# Altium project Subway.PrjPcb
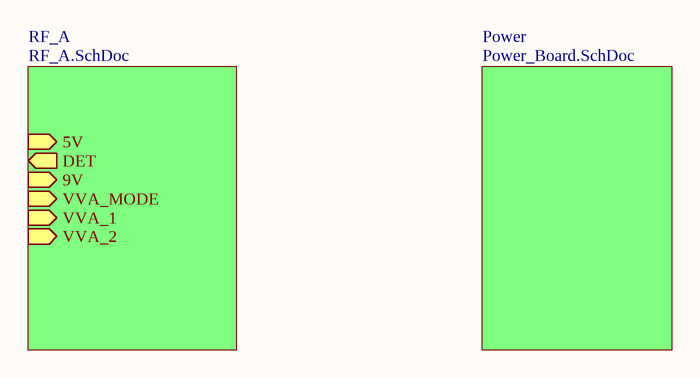
[diagram p0: Top_Subway.SchDoc]
3 sheets, 80 parts. Net scope: hierarchical (ports join the sheet entries above them; power ports are global).
Sheets:
  Top_Subway.SchDoc
    RF_A = RF_A.SchDoc
    Power = Power_Board.SchDoc

## Sheet Top_Subway.SchDoc
size A; SheetNumber: 1; SheetTotal: 3

### Sub-sheets
Power = Power_Board.SchDoc: no entries
RF_A = RF_A.SchDoc: 5V (in), DET (out), 9V (in), VVA_MODE (in), VVA_1 (in), VVA_2 (in)

## Sheet RF_A.SchDoc
size A3; SheetNumber: 2; SheetTotal: 2
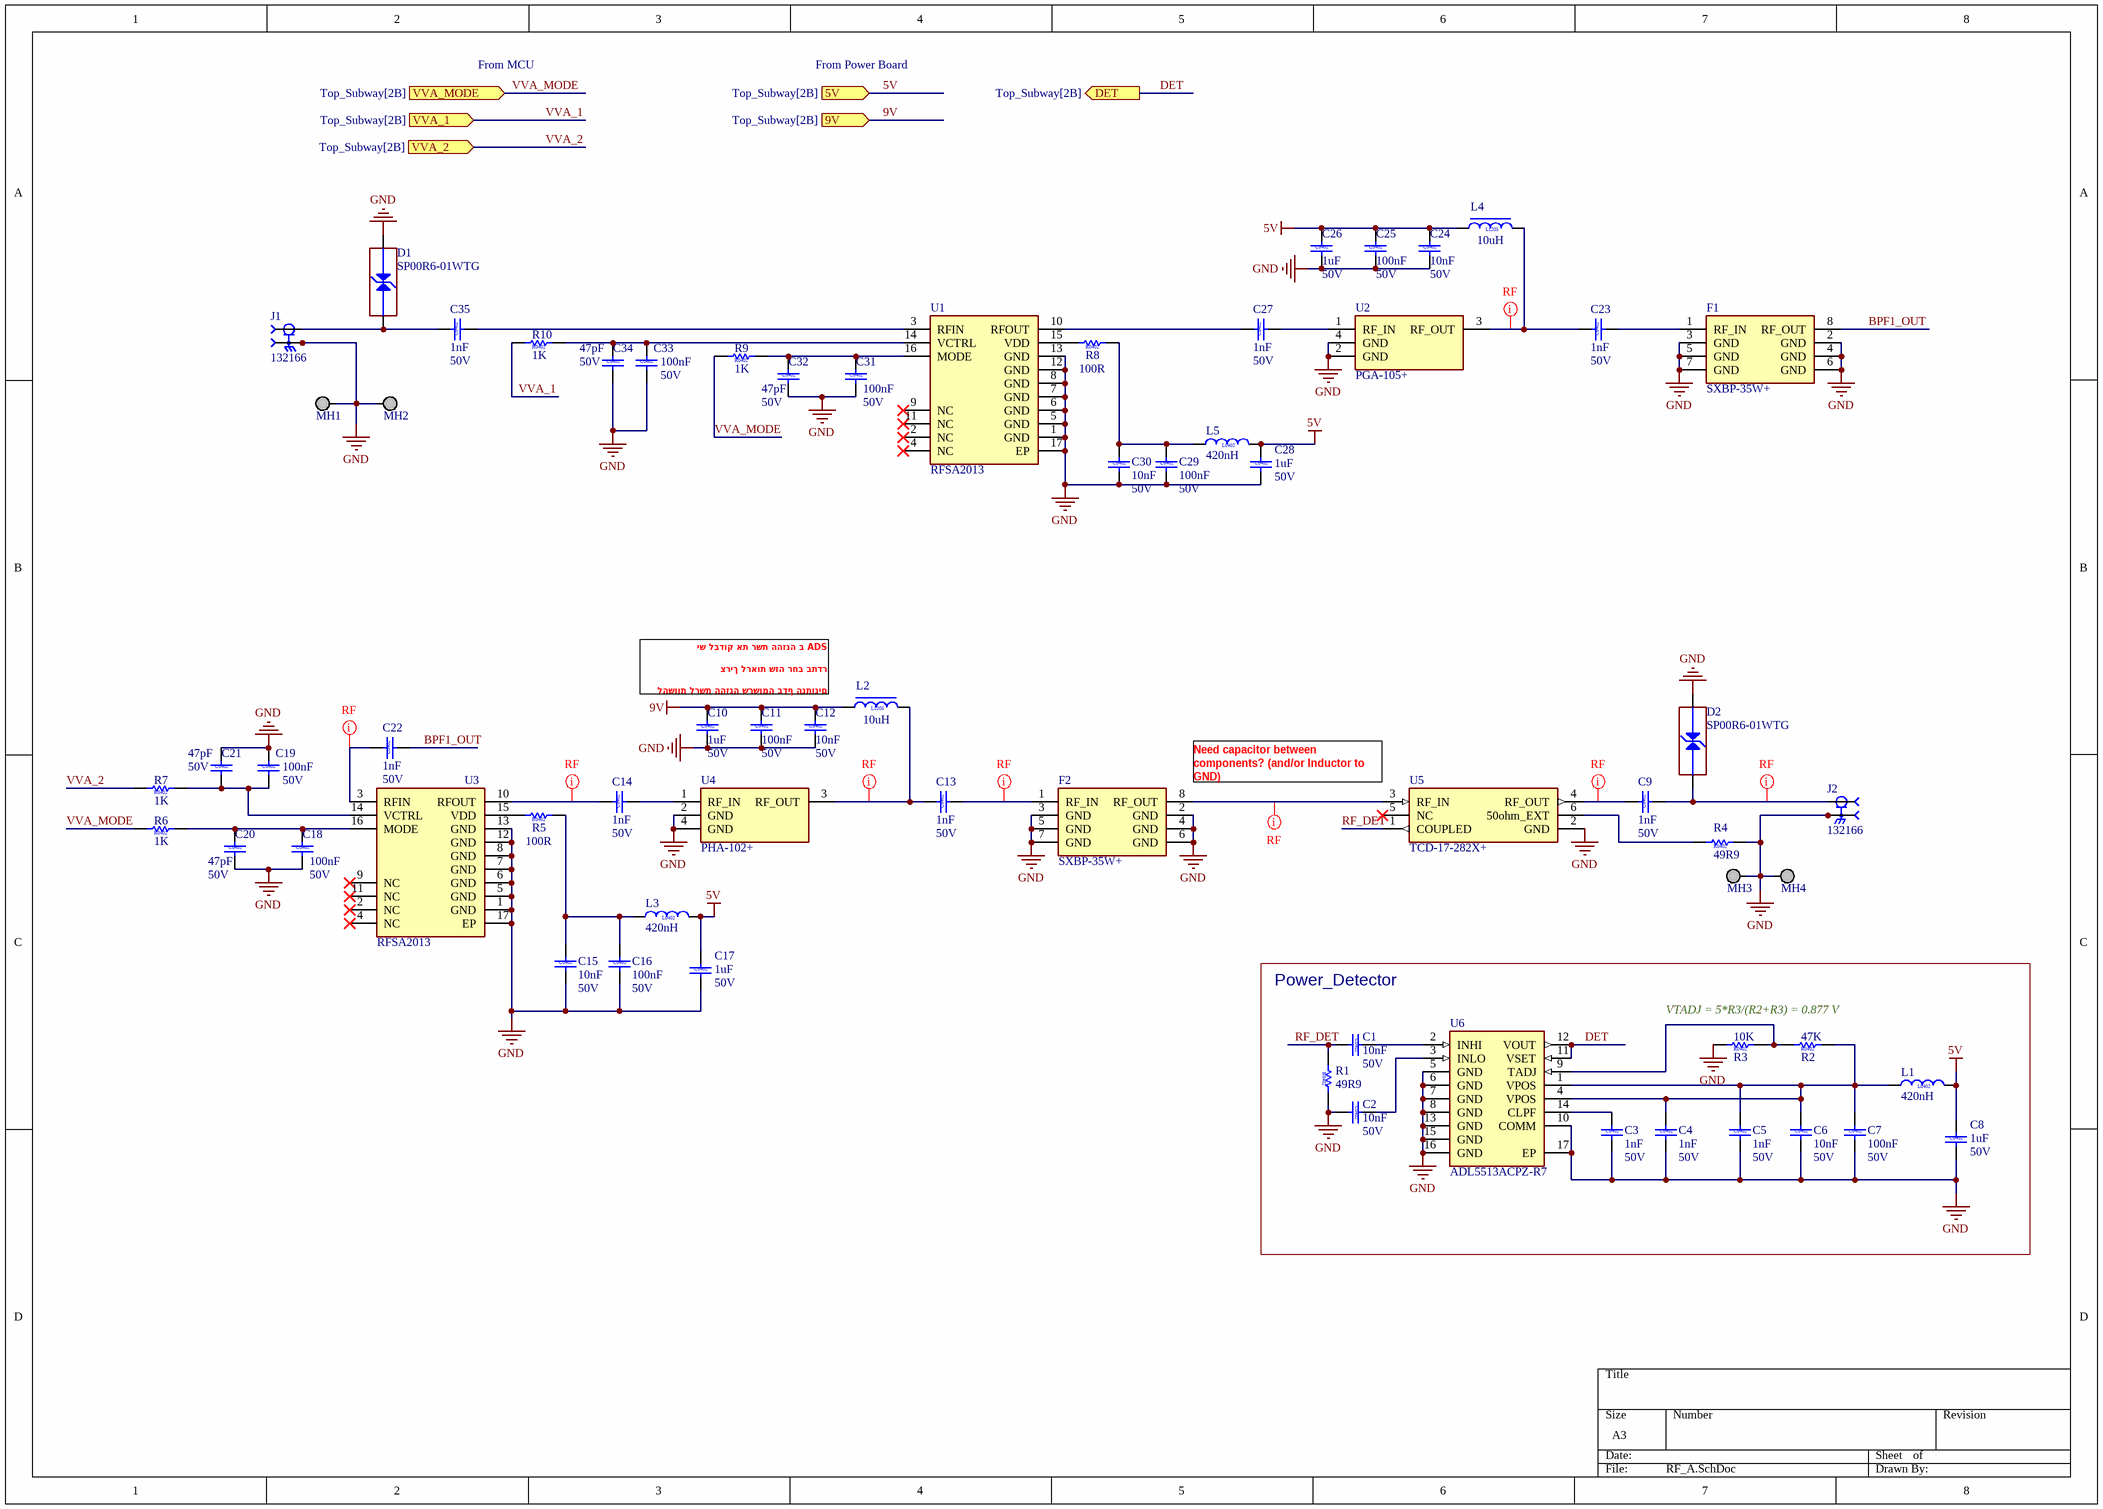
[diagram p1: RF_A.SchDoc]

### Parts
C1  value 10nF  Voltage_Rating: 50V  [C0402]  (hidden comment: GRM155R71H103KA88D)
C2  value 10nF  Voltage_Rating: 50V  [C0402]  (hidden comment: GRM155R71H103KA88D)
C3  value 1nF  Voltage_Rating: 50V  [C0402]  (hidden comment: GRM155R71H102KA01D)
C4  value 1nF  Voltage_Rating: 50V  [C0402]  (hidden comment: GRM155R71H102KA01D)
C5  value 1nF  Voltage_Rating: 50V  [C0402]  (hidden comment: GRM155R71H102KA01D)
C6  value 10nF  Voltage_Rating: 50V  [C0402]  (hidden comment: GRM155R71H103KA88D)
C7  value 100nF  Voltage_Rating: 50V  [C0402]  (hidden comment: GRM155R71H104KE14D)
C8  value 1uF  Voltage_Rating: 50V  [C0402]  (hidden comment: GRM155R61H105KE05D)
C9  value 1nF  Voltage_Rating: 50V  [C0402]  (hidden comment: GRM155R71H102KA01D)
C10  value 1uF  Voltage_Rating: 50V  [C0402]  (hidden comment: GRM155R61H105KE05D)
C11  value 100nF  Voltage_Rating: 50V  [C0402]  (hidden comment: GRM155R71H104KE14D)
C12  value 10nF  Voltage_Rating: 50V  [C0402]  (hidden comment: GRM155R71H103KA88D)
C13  value 1nF  Voltage_Rating: 50V  [C0402]  (hidden comment: GRM155R71H102KA01D)
C14  value 1nF  Voltage_Rating: 50V  [C0402]  (hidden comment: GRM155R71H102KA01D)
C15  value 10nF  Voltage_Rating: 50V  [C0402]  (hidden comment: GRM155R71H103KA88D)
C16  value 100nF  Voltage_Rating: 50V  [C0402]  (hidden comment: GRM155R71H104KE14D)
C17  value 1uF  Voltage_Rating: 50V  [C0402]  (hidden comment: GRM155R61H105KE05D)
C18  value 100nF  Voltage_Rating: 50V  [C0402]  (hidden comment: GRM155R71H104KE14D)
C19  value 100nF  Voltage_Rating: 50V  [C0402]  (hidden comment: GRM155R71H104KE14D)
C20  value 47pF  Voltage_Rating: 50V  [C0402]  (hidden comment: GRM1555C1H470GA01D)
C21  value 47pF  Voltage_Rating: 50V  [C0402]  (hidden comment: GRM1555C1H470GA01D)
C22  value 1nF  Voltage_Rating: 50V  [C0402]  (hidden comment: GRM155R71H102KA01D)
C23  value 1nF  Voltage_Rating: 50V  [C0402]  (hidden comment: GRM155R71H102KA01D)
C24  value 10nF  Voltage_Rating: 50V  [C0402]  (hidden comment: GRM155R71H103KA88D)
C25  value 100nF  Voltage_Rating: 50V  [C0402]  (hidden comment: GRM155R71H104KE14D)
C26  value 1uF  Voltage_Rating: 50V  [C0402]  (hidden comment: GRM155R61H105KE05D)
C27  value 1nF  Voltage_Rating: 50V  [C0402]  (hidden comment: GRM155R71H102KA01D)
C28  value 1uF  Voltage_Rating: 50V  [C0402]  (hidden comment: GRM155R61H105KE05D)
C29  value 100nF  Voltage_Rating: 50V  [C0402]  (hidden comment: GRM155R71H104KE14D)
C30  value 10nF  Voltage_Rating: 50V  [C0402]  (hidden comment: GRM155R71H103KA88D)
C31  value 100nF  Voltage_Rating: 50V  [C0402]  (hidden comment: GRM155R71H104KE14D)
C32  value 47pF  Voltage_Rating: 50V  [C0402]  (hidden comment: GRM1555C1H470GA01D)
C33  value 100nF  Voltage_Rating: 50V  [C0402]  (hidden comment: GRM155R71H104KE14D)
C34  value 47pF  Voltage_Rating: 50V  [C0402]  (hidden comment: GRM1555C1H470GA01D)
C35  value 1nF  Voltage_Rating: 50V  [C0402]  (hidden comment: GRM155R71H102KA01D)
D1  SP00R6-01WTG  [DIO_TVS_FLIPCHIP2]
D2  SP00R6-01WTG  [DIO_TVS_FLIPCHIP2]
F1  SXBP-35W+  [FIL_HF1139]
F2  SXBP-35W+  [FIL_HF1139]
J1  132166  [CON_SMA_132166]
J2  132166  [CON_SMA_132166]
L1  value 420nH  [L0402DF]  (hidden comment: 0402DF-421XJRW)
L2  value 10uH  [L1205POC]  (hidden comment: 1205POC-103MRC)
L3  value 420nH  [L0402DF]  (hidden comment: 0402DF-421XJRW)
L4  value 10uH  [L1205POC]  (hidden comment: 1205POC-103MRC)
L5  value 420nH  [L0402DF]  (hidden comment: 0402DF-421XJRW)
MH1  Mounting Hole 2.4mm  [MH_TH_2P4MM]  (value not drawn)
MH2  Mounting Hole 2.4mm  [MH_TH_2P4MM]  (value not drawn)
MH3  Mounting Hole 2.4mm  [MH_TH_2P4MM]  (value not drawn)
MH4  Mounting Hole 2.4mm  [MH_TH_2P4MM]  (value not drawn)
R1  value 49R9  [R0402]  (hidden comment: RC0402FR-0749R9L)
R2  value 47K  [R0402]  (hidden comment: RC0402FR-0747KL)
R3  value 10K  [R0402]  (hidden comment: RC0402FR-0710KL)
R4  value 49R9  [R0402]  (hidden comment: RC0402FR-0749R9L)
R5  value 100R  [R0402]  (hidden comment: RC0402FR-07100RL)
R6  value 1K  [R0402]  (hidden comment: RC0402FR-071KL)
R7  value 1K  [R0402]  (hidden comment: RC0402FR-071KL)
R8  value 100R  [R0402]  (hidden comment: RC0402FR-07100RL)
R9  value 1K  [R0402]  (hidden comment: RC0402FR-071KL)
R10  value 1K  [R0402]  (hidden comment: RC0402FR-071KL)
U1  RFSA2013  [VVA_QFN-16]
U2  PGA-105+  [AMP_DF782]
U3  RFSA2013  [VVA_QFN-16]
U4  PHA-102+  [AMP_DF782]
U5  TCD-17-282X+  [SPLT_COUP_DB1627]
U6  ADL5513ACPZ-R7  [PWD_QFN50P300X300X80-17N-D]

### Blocks framed on the sheet
Power_Detector: C1-C8 L1 R1-R3 U6

### Ports
5V (in, see Top_Subway[2B]), 9V (in, see Top_Subway[2B]), DET (out, see Top_Subway[2B]), VVA_1 (in, see Top_Subway[2B]), VVA_2 (in, see Top_Subway[2B]), VVA_MODE (in, see Top_Subway[2B])

### Nets
5V: C8.2 C17.2 C24.2 C25.2 C26.2 C28.2 L1.2 L3.2 L4.1 L5.2 ; port 5V
9V: C10.2 C11.2 C12.2 L2.1 ; port 9V
GND: C2.1 C3.1 C4.1 C5.1 C6.1 C7.1 C8.1 C10.1 C11.1 C12.1 C15.1 C16.1 C17.1 C18.1 C19.2 C20.1 C21.2 C24.1 C25.1 C26.1 C28.1 C29.1 C30.1 C31.1 C32.1 C33.1 C34.1 D1.2(GND) D2.2(GND) F1.2(GND) F1.3(GND) F1.4(GND) F1.5(GND) F1.6(GND) F1.7(GND) F2.2(GND) F2.3(GND) F2.4(GND) F2.5(GND) F2.6(GND) F2.7(GND) J1.2_1(GND) J1.2_2(GND) J1.3_1(GND) J1.3_2(GND) J2.2_1(GND) J2.2_2(GND) J2.3_1(GND) J2.3_2(GND) MH1.MH MH2.MH MH3.MH MH4.MH R1.2 R3.1 R4.2 U1.1(GND) U1.5(GND) U1.6(GND) U1.7(GND) U1.8(GND) U1.12(GND) U1.13(GND) U1.17(EP) U2.2(GND) U2.4(GND) U3.1(GND) U3.5(GND) U3.6(GND) U3.7(GND) U3.8(GND) U3.12(GND) U3.13(GND) U3.17(EP) U4.2(GND) U4.4(GND) U5.2(GND) U6.5(GND) U6.6(GND) U6.7(GND) U6.8(GND) U6.10(COMM) U6.13(GND) U6.15(GND) U6.16(GND) U6.17(EP)
BPF1_OUT: C22.1 F1.8(RF_OUT)
DET: U6.11(VSET) U6.12(VOUT) ; port DET
RF_DET: C1.1 R1.1 U5.1(COUPLED)
VVA_1: R10.1 ; port VVA_1
VVA_2: R7.1 ; port VVA_2
VVA_MODE: R6.1 R9.1 ; port VVA_MODE
NetC1_2: C1.2 U6.2(INHI)
NetC2_2: C2.2 U6.3(INLO)
NetC3_2: C3.2 U6.14(CLPF)
NetC4_2: C4.2 C5.2 C6.2 C7.2 L1.1 R2.2 U6.1(VPOS) U6.4(VPOS)
NetC9_1: C9.1 D2.1(IO1) J2.1
NetC9_2: C9.2 U5.4(RF_OUT)
NetC13_1: C13.1 F2.1(RF_IN)
NetC13_2: C13.2 L2.2 U4.3(RF_OUT)
NetC14_1: C14.1 U4.1(RF_IN)
NetC14_2: C14.2 U3.10(RFOUT)
NetC15_2: C15.2 C16.2 L3.1 R5.2
NetC18_2: C18.2 C20.2 R6.2 U3.16(MODE)
NetC19_1: C19.1 C21.1 R7.2 U3.14(VCTRL)
NetC22_2: C22.2 U3.3(RFIN)
NetC23_1: C23.1 F1.1(RF_IN)
NetC23_2: C23.2 L4.2 U2.3(RF_OUT)
NetC27_1: C27.1 U2.1(RF_IN)
NetC27_2: C27.2 U1.10(RFOUT)
NetC29_2: C29.2 C30.2 L5.1 R8.2
NetC31_2: C31.2 C32.2 R9.2 U1.16(MODE)
NetC33_2: C33.2 C34.2 R10.2 U1.14(VCTRL)
NetC35_1: C35.1 U1.3(RFIN)
NetC35_2: C35.2 D1.1(IO1) J1.1
NetF2_8: F2.8(RF_OUT) U5.3(RF_IN)
NetR2_1: R2.1 R3.2 U6.9(TADJ)
NetR4_1: R4.1 U5.6(50ohm_EXT)
NetR5_1: R5.1 U3.15(VDD)
NetR8_1: R8.1 U1.15(VDD)

Not connected (* = marked no-connect by the designer): U1 2(NC)* 4(NC)* 9(NC)* 11(NC)*; U3 2(NC)* 4(NC)* 9(NC)* 11(NC)*; U5 5(NC)*

### Layout directives
mark named RF: NetC9_1, NetC9_2, NetC13_1, NetC13_2, NetC14_2, NetC22_2, NetC23_2, NetF2_8

### Notes on the sheet
- From MCU
- From Power Board
- יש לבדוק את רשת ההזנה ב ADS
  צריך לראות שזה רחב בתדר
  להשוות לרשת ההזנה שרשומה בדף הנתונים
- Need capacitor between components? (and/or Inductor to GND)
- VTADJ = 5*R3/(R2+R3) = 0.877 V
- (in symbol IND-102) L0402
- (in symbol IND-301) L1205

### Library data of the parts
C1 C2 C6 C12 C15 C24 C30 = CAP-103: Capacitor, MLCC, 10nF, 50V, X7R, 10%, 0402, T=0.5mm; Manufacturer: MURATA; Catalog_Number: 821063523; Part_Type: Capacitor; Manufacturer_Part_Number: GRM155R71H103KA88D; Package: C0402; ComponentLink1Description: Datasheet; ComponentLink1URL: http://tunmcdsvn.tun.st.com/Component_Datasheet_Library/Trunk/Capacitors/Murata_Capacitor_GR_series; Price(ILS): 0.1
C3-C5 C9 C13 C14 C22 C23 C27 C35 = CAP-102: Capacitor, MLCC, 1nF, 50V, X7R, 10%, 0402, T=0.5mm; Manufacturer: MURATA; Catalog_Number: 800599890; Part_Type: Capacitor; Manufacturer_Part_Number: GRM155R71H102KA01D; Package: C0402; ComponentLink1Description: Datasheet; ComponentLink1URL: http://tunmcdsvn.tun.st.com/Component_Datasheet_Library/Trunk/Capacitors/Murata_Capacitor_GR_series; Price(ILS): 0.1
C7 C11 C16 C18 C19 C25 C29 C31 C33 = CAP-104: Capacitor, MLCC, 100nF, 50V, X7R, 10%, 0402, T=0.5mm; Manufacturer: MURATA; Catalog_Number: 821614902; Part_Type: Capacitor; Manufacturer_Part_Number: GRM155R71H104KE14D; Package: C0402; ComponentLink1Description: Datasheet; ComponentLink1URL: http://tunmcdsvn.tun.st.com/Component_Datasheet_Library/Trunk/Capacitors/Murata_Capacitor_GR_series; Price(ILS): 0.1
C8 C10 C17 C26 C28 = CAP-001: Capacitor, MLCC, 1uF, 50V, X5R, 10%, 0402, T=0.5mm; Manufacturer: MURATA; Catalog_Number: 821615100; Part_Type: Capacitor; Manufacturer_Part_Number: GRM155R61H105KE05D; Package: C0402; ComponentLink1Description: Datasheet; ComponentLink1URL: http://tunmcdsvn.tun.st.com/Component_Datasheet_Library/Trunk/Capacitors/Murata_Capacitor_GR_series; Price(ILS): 0.1
C20 C21 C32 C34 = CAP-207: Capacitor, MLCC, 47pF, 50V, C0G 2%, 0402, T=0.5mm; Manufacturer_Part_Number: GRM1555C1H470FA01D; Manufacturer: MURATA; Catalog_Number: 821662540; Part_Type: Capacitor; Package: C0402; ComponentLink1Description: Datasheet; ComponentLink1URL: http://tunmcdsvn.tun.st.com/Component_Datasheet_Library/Trunk/Capacitors/Murata_Capacitor_GR_series; Price(ILS): 0.1
D1 D2 = DIO-012: Diode, TVS, Bidirectional, 0.3V working, 0.7V breakdown, 2.5V clamping, 3A; Manufacturer: Littelfuse; Catalog_Number: 821614236; Datasheet Link: https://www.mouser.co.il/datasheet/2/240/media-3320839.pdf; Manufacturer_Part_Number: SP00R6-01WTG; Mouser Part Number: 576-SP00R6-01WTG; Mouser Price/Stock: https://www.mouser.co.il/ProductDetail/Littelfuse/SP00R6-01WTG?qs=Rp5uXu7WBW8WFDFDswwZLA%3D%3D; Value: 3A; Part_Type: Diode; Price(ILS): 2.67
F1 = RFC-234: Filter, BPF, 24-46MHz, 1dB IL; Manufacturer: Mini-Circuits; Value: BPF 24-46MHz; Datasheet Link: https://www.minicircuits.com/pdfs/SXBP-35W+.pdf; Height: 6.86mm; Manufacturer_Part_Number: SXBP-35W+; Part_Type: Filter; Price(ILS): 75.4; Catalog_Number: *
F2 = RFC-218: Filter, BPF, 24-46MHz, 1dB IL; Manufacturer: Mini-Circuits; Value: BPF 24-46MHz; Datasheet Link: https://www.minicircuits.com/pdfs/SXBP-35W+.pdf; Height: 6.86mm; Manufacturer_Part_Number: SXBP-35W+; Part_Type: Filter; Price(ILS): 75.4; Catalog_Number: *
J1 J2 = CON-304: Connector, SMA Jack, Female Socket 50Ohm, DC-12.4GHz, Flange Mount; Manufacturer: Amphenol; Catalog_Number: 821615399; Part_Type: Connector; Manufacturer_Part_Number: 132166; Price(ILS): 51
L1 L3 L5 = IND-102: Inductor, RF, 420nH, 400mA, 510mOhm DCR, 1100MHz SRF, 5%, 0402, 0.66mm; Manufacturer: COILCRAFT; Catalog_Number: 821660769; Datasheet Link: https://www.mouser.co.il/datasheet/2/597/0402df-1076561.pdf; Manufacturer_Part_Number: 0402DF-421XJRW; Mouser Part Number: 994-0402DF-421XJRW; Mouser Price/Stock: https://www.mouser.co.il/ProductDetail/Coilcraft/0402DF-421XJRW?qs=0gpYmj5HUPI37bHPtafxrQ%3D%3D; Price(ILS): 6.89; Part_Type: Inductor
L2 L4 = IND-301: RF Choke,10uH, 560mA, 1Ohm DCR, 165MHz SRF, 20%, 1205, 2.36mm; Manufacturer: COILCRAFT; Part_Type: Inductor; Catalog_Number: 821660777; Datasheet Link: https://www.coilcraft.com/getmedia/a5b3a5d7-eb2c-4be4-b0b2-a6208c9c961a/1205POC.pdf; Manufacturer_Part_Number: 1205POC-103MRC; Price(ILS): 5.55
MH1-MH4 = MEC-005: Mounting Hole 2.4mm drill hole
R1 R4 = RES-104: Resistor,49R9,0402,1%,1/16W; Manufacturer: YAGEO; Catalog_Number: 800619939; Part_Type: Resistor; Manufacturer_Part_Number: RC0402FR-0749R9L; Package: R0402; ComponentLink1Description: Datasheet; ComponentLink1URL: http://tunmcdsvn.tun.st.com/Component_Datasheet_Library/Trunk/Resistors/Yageo_Resistor_RC0402-series; Price(ILS): 0.1
R2 = RES-011: Resistor,47K,0402,1%,1/16W; Manufacturer: YAGEO; Catalog_Number: 821615186; Manufacturer_Part_Number: RC0402FR-0747KL; ComponentLink1Description: Datasheet; Part_Type: Resistor; Package: R0402; ComponentLink1URL: http://tunmcdsvn.tun.st.com/Component_Datasheet_Library/Trunk/Resistors/Yageo_Resistor_RC0402-series; Price(ILS): 0.1
R3 = RES-007: Resistor,10K,0402,1%,1/16W; Manufacturer: YAGEO; Catalog_Number: 800746930; Part_Type: Resistor; Manufacturer_Part_Number: RC0402FR-0710KL; Package: R0402; ComponentLink1Description: Datasheet; ComponentLink1URL: http://tunmcdsvn.tun.st.com/Component_Datasheet_Library/Trunk/Resistors/Yageo_Resistor_RC0402-series; Price(ILS): 0.1
R5 R8 = RES-106: Resistor,100R,0402,1%,1/16W; Manufacturer: YAGEO; Catalog_Number: 988943207; Provided_By: SUBCO; Part_Type: Resistor; Manufacturer_Part_Number: RC0402FR-07100RL; ComponentLink1Description: Datasheet; Package: R0402; ComponentLink1URL: http://tunmcdsvn.tun.st.com/Component_Datasheet_Library/Trunk/Resistors/Yageo_Resistor_RC0402-series; Price(ILS): 0.1
R6 R7 R9 R10 = RES-001: Resistor,1K,0402,1%,1/16W; Manufacturer: YAGEO; Catalog_Number: 800992010; Manufacturer_Part_Number: RC0402FR-071KL; ComponentLink1Description: Datasheet; Status: Released; Part_Type: Resistor; Package: R0402; ComponentLink1URL: http://tunmcdsvn.tun.st.com/Component_Datasheet_Library/Trunk/Resistors/Yageo_Resistor_RC0603-series; Price(ILS): 0.1
U1 U3 = RFC-107: VVA, RF Attenuator 2.6-35dB .05-6GHz / 0-5VC; Manufacturer: Qorvo; Manufacturer_Part_Number: RFSA2013TR7; Datasheet Link: https://www.qorvo.com/products/d/da001051; Height: 0.9mm; Mouser Part Number: 772-RFSA2013; Mouser Price/Stock: https://www.mouser.co.uk/ProductDetail/Qorvo/RFSA2013TR7?qs=tkvX2tz6JTHzbZ5xBcOnCA%3D%3D; Catalog_Number: *; Part_Type: VVA; Price(ILS): 24.5
U2 = RFC-109: LNA, RF Amplifier .04-2.6GHz Gain 15-16.5dB, NF 1.7-2.1dB, OIP3 33-39dBm, 5V; Manufacturer: Mini-Circuits; Datasheet Link: https://www.minicircuits.com/pdfs/PGA-105+.pdf; Height: 1.6mm; Manufacturer_Part_Number: PGA-105+; Mouser Part Number: 139-PGA-105; Catalog_Number: *; Part_Type: LNA; Price(ILS): 9.1
U4 = RFC-106: RF Amplifier, High Linearity, .05-6GHz Gain 14.6dB, NF 3.5dB, OIP3 45-50dBm, 9V; Manufacturer: Mini-Circuits; Part_Type: AMP; Datasheet Link: https://minicircuits.com/pdfs/PHA-102+.pdf; Height: 1.6mm; Manufacturer_Part_Number: PHA-102+; Mouser Part Number: 139-PHA-102+; Mouser Price/Stock: https://www.mouser.co.uk/ProductDetail/Mini-Circuits/PHA-102%2b?qs=yqaQSyyJnNgUPwUb%252Br9Ihw%3D%3D; Catalog_Number: *; Price(ILS): 37
U5 = RFC-301: Coupler, 5-2850MHz, 0.7-1.9dB IL, 17dB Coupling; Manufacturer: Mini-Circuits; Catalog_Number: 821614260; Datasheet Link: https://www.minicircuits.com/pdfs/TCD-17-282X+.pdf; Manufacturer_Part_Number: TCD-17-282X+; Mouser Part Number: 139-TCD-17-282X; Mouser Price/Stock: https://www.mouser.co.il/ProductDetail/Mini-Circuits/TCD-17-282X%2b?qs=xZ%2FP%252Ba9zWqZsFnE%252B%252B%2F2NvA%3D%3D; Price(ILS): 9.35; Part_Type: Coupler
U6 = RFC-104: Power Detector, RF Detector Next Gen 75 dB Log Detector; Manufacturer: Analog Devices; Catalog_Number: 821606896; Datasheet Link: https://www.analog.com/media/en/technical-documentation/data-sheets/ADL5513.pdf; Height: 0.8mm; Manufacturer_Part_Number: ADL5513ACPZ-R7; Mouser Part Number: 584-ADL5513ACPZ-R7; Mouser Price/Stock: https://www.mouser.co.uk/ProductDetail/Analog-Devices/ADL5513ACPZ-R7?qs=BpaRKvA4VqGe6%2FPlUcoEpw%3D%3D; Arrow Price/Stock: https://www.arrow.com/en/products/adl5513acpz-r7/analog-devices?region=nac; Part_Type: Power Detector; Price(ILS): 62.03

## Sheet Power_Board.SchDoc
size A; SheetNumber: 2; SheetTotal: 3
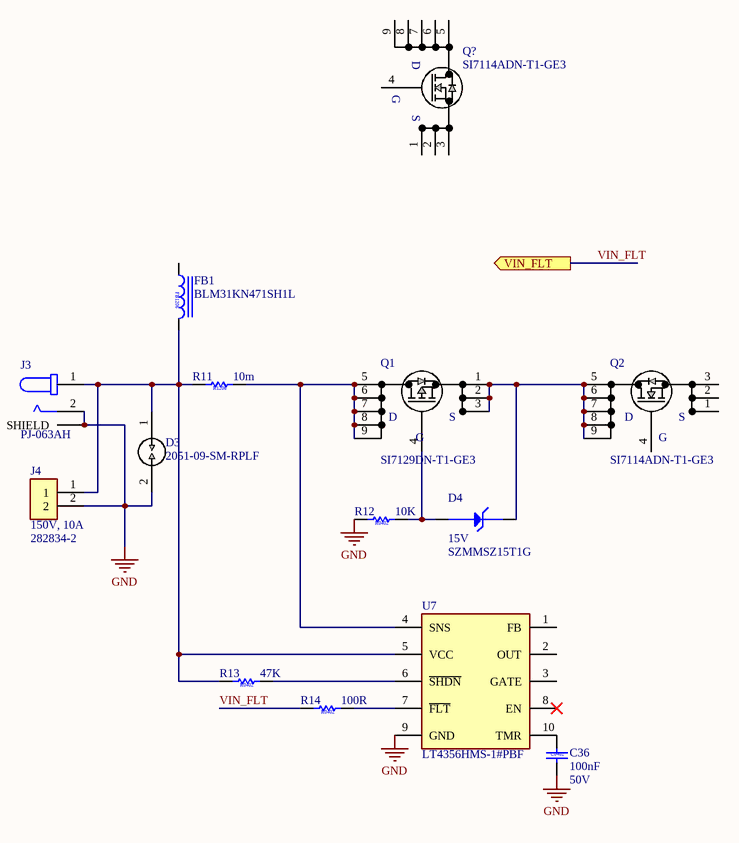
[diagram p2: Power_Board.SchDoc]

### Parts
C36  value 100nF  Voltage_Rating: 50V  [C0402]  (hidden comment: GRM155R71H104KE14D)
D3  2051-09-SM-RPLF  [DIO_GAS_205109SMRPLF]
D4  SZMMSZ15T1G  value 15V  [DIO_ZEN_SOD3716X135N]
FB1  BLM31KN471SH1L  [FB1206]
J3  PJ-063AH  [CON_CUI_PJ-063AH]
J4  282834-2  value 150V, 10A  [CON_TE_282834-2]
Q1  SI7129DN-T1-GE3  [MOS_POWERPACK-1212-8]
Q2  SI7114ADN-T1-GE3  [MOS_POWERPACK-1212-8]
Q?  SI7114ADN-T1-GE3  [MOS_POWERPACK-1212-8]
R11  value 10m  [R1206]  (hidden comment: PA1206FRE470R01Z)
R12  value 10K  [R0402]  (hidden comment: RC0402FR-0710KL)
R13  value 47K  [R0402]  (hidden comment: RC0402FR-0747KL)
R14  value 100R  [R0402]  (hidden comment: RC0402FR-07100RL)
U7  LT4356HMS-1#PBF  [SPD_SOP50P490X110-10N]

### Ports
VIN_FLT (out)

### Nets
GND: C36.1 D3.2 J3.2 J3.S1(SHIELD) J3.S2(SHIELD) J4.2 R12.1 U7.9(GND)
VIN_FLT: R14.1 ; port VIN_FLT
NetC36_2: C36.2 U7.10(TMR)
NetD3_1: D3.1 FB1.2 J3.1 J4.1 R11.1 R13.1 U7.5(VCC)
NetD4_1: D4.1(IO1) Q1.1(S) Q1.2(S) Q1.3(S) Q2.5(D) Q2.6(D) Q2.7(D) Q2.8(D) Q2.9(D)
NetD4_2: D4.2(GND) Q1.4(G) R12.2
NetQ1_5: Q1.5(D) Q1.6(D) Q1.7(D) Q1.8(D) Q1.9(D) R11.2 U7.4(SNS)
NetR13_2: R13.2 U7.6(~{SHDN})
NetR14_2: R14.2 U7.7(~{FLT})

Not connected (* = marked no-connect by the designer): FB1 1; Q2 1(S) 2(S) 3(S) 4(G); Q? 1(S) 2(S) 3(S) 4(G) 5(D) 6(D) 7(D) 8(D) 9(D); U7 1(FB) 2(OUT) 3(GATE) 8(EN)*

### Notes on the sheet
- (in symbol IND-203) FB1206

### Library data of the parts
C36 = CAP-104: as C7 on sheet RF_A; Part_Type: Capacitor; Manufacturer_Part_Number: GRM155R71H104KE14D; Package: C0402; ComponentLink1Description: Datasheet; ComponentLink1URL: http://tunmcdsvn.tun.st.com/Component_Datasheet_Library/Trunk/Capacitors/Murata_Capacitor_GR_series; Price(ILS): 0.1
D3 = DIO-201: Gas Discharge Tube, 90V DC Sparkover, 2kA Peak Pulse Current; Manufacturer: Bourns; Part_Type: Diode; Catalog_Number: 821200342; Datasheet Link: https://datasheet.datasheetarchive.com/originals/distributors/Datasheets-DGA18/380742.pdf; Manufacturer_Part_Number: 2051-09-SM-RPLF; Mouser Part Number: 652-2051-09-SM-RPLF; Mouser Price/Stock: https://www.mouser.co.uk/ProductDetail/Bourns/2051-09-SM-RPLF?qs=oyIm%2F3giSj7NHFY1d4mMJA%3D%3D; Arrow Part Number: 2051-09-SM-RPLF; Arrow Price/Stock: https://www.arrow.com/en/products/2051-09-sm-rplf/bourns?region=nac; Price(ILS): 3.08
D4 = DIO-001: Diode, Zener, 15V, 500mW, Low Current for Voltage Regulator; Manufacturer: onsemi; Catalog_Number: 821615283; Datasheet Link: chrome-extension://efaidnbmnnnibpcajpcglclefindmkaj/https://www.mouser.co.il/datasheet/2/308/1/MMSZ2V4T1_D-2316151.pdf; Manufacturer_Part_Number: SZMMSZ15T1G; Mouser Part Number: 863-SZMMSZ15T1G; Mouser Price/Stock: https://www.mouser.co.il/ProductDetail/onsemi/SZMMSZ15T1G?qs=PJJcWtbOkNXOKlSj9GlfUQ%3D%3D; Part_Type: Diode; Price(ILS): 1.72
FB1 = IND-203: Ferrite bead, 470R@100MHz, 4A, 20mOhm DCR, 25%, 1206; Manufacturer: MURATA; Catalog_Number: 821614210; Mouser Part Number: 81-BLM31KN471SH1L; Mouser Price/Stock: https://www.mouser.co.il/ProductDetail/Murata-Electronics/BLM31KN471SH1L?qs=EU6FO9ffTwc7C8y3YWE9tQ%3D%3D; Manufacturer_Part_Number: BLM31KN471SH1L; Datasheet Link: https://www.mouser.co.il/datasheet/2/281/QNFA9148-1915696.pdf; Part_Type: Ferrite bead; Value: 470R@100MHz; Price(ILS): 0.3
J3 = CON-005: Connector, Power Barrel Connector Jack, 2.10mm ID (0.083"), 5.50mm OD (0.217"), 24V, 8A, Through Hole, Right Angle; Manufacturer: CUI Devices; Catalog_Number: 821615011; Mouser Price/Stock: https://www.mouser.co.il/ProductDetail/CUI-Devices/PJ-063AH?qs=WyjlAZoYn51bQfA53nMcVA%3D%3D; Mouser Part Number: 490-PJ-063AH; Datasheet Link: https://www.cuidevices.com/product/product-resources/pj-063ah.pdf; Voltage Rating: 24V; Current Rating: 8A; Part_Type: Connector; Manufacturer_Part_Number: PJ-063AH; Price(ILS): 5.58
J4 = CON-201: Connector, Fixed Terminal Block, 2 Position, 2.54mm, .100" pitch, Through All, 150V, 10A, 16-30 AWG, Screw Connection; Manufacturer: TE Connectivity; Catalog_Number: 821615402; Datasheet Link: https://www.te.com/commerce/DocumentDelivery/DDEController?Action=showdoc&DocId=Catalog+Section%7F1308389_EUROSTYLE_TERMINAL_BLOCKS%7F0607%7Fpdf%7FEnglish%7FENG_CS_1308389_EUROSTYLE_TERMINAL_BLOCKS_0607.pdf%7F282834-2; Manufacturer_Part_Number: 282834-2; Mouser Part Number: 571-282834-2; Mouser Price/Stock: https://www.mouser.co.il/ProductDetail/TE-Connectivity/282834-2?qs=A%252Bip%252BNCYi6N8cVKuk8xDog%3D%3D; Part_Type: Connector; Price(ILS): 4.59
Q1 = TRA-002: MOSFET P-Channel, 1.5-2.8V Vth, 35A, 20mOhm Rds, -30V Vds, -20V Vgs, PowerPAK 1212-8; Manufacturer: Vishay; Catalog_Number: 821603170; Datasheet Link: https://www.vishay.com/docs/68966/si7129dn.pdf; Manufacturer_Part_Number: SI7129DN-T1-GE3; Mouser Part Number: 781-SI7129DN-GE3; Mouser Price/Stock: https://www.mouser.co.il/ProductDetail/Vishay-Semiconductors/SI7129DN-T1-GE3?qs=LWWr1WFOkdGr29jiBIQirw%3D%3D; Arrow Part Number: SI7129DN-T1-GE3; Arrow Price/Stock: https://www.arrow.com/en/products/si7129dn-t1-ge3/vishay?region=nac; Part_Type: MOSFET; Price(ILS): 3.36
Q2 Q? = TRA-001: MOSFET N-Channel, 1.2-2.5V Vth, 35A, 9.8mOhm Rds, 30V Vds, 20V Vgs, PowerPAK 1212-8; Manufacturer: Vishay; Catalog_Number: 821603234; Datasheet Link: https://www.vishay.com/docs/68932/si7114ad.pdf; Manufacturer_Part_Number: SI7114ADN-T1-GE3; Mouser Part Number: 781-SI7114ADN-T1-GE3; Mouser Price/Stock: https://www.mouser.co.il/ProductDetail/Vishay-Semiconductors/SI7114ADN-T1-GE3?qs=cPOO8qjhL6Mzxqw2gJeXWA%3D%3D; Arrow Part Number: SI7114DAN-T1-GE3; Arrow Price/Stock: https://www.arrow.com/en/products/si7114adn-t1-ge3/vishay?region=nac; Part_Type: MOSFET; Price(ILS): 3.73
R11 = RES-401: Resistor,10m,1206,1%,1W; Manufacturer: YAGEO; Alternate_Part_Number: WSLP1206R0100FEA; Alternate_Manufacturer: Vishay; Catalog_Number: 821615240; Part_Type: Resistor; Manufacturer_Part_Number: PA1206FRE470R01Z; Package: R1206; ComponentLink1Description: Datasheet; ComponentLink1URL: http://tunmcdsvn.tun.st.com/Component_Datasheet_Library/Trunk/Resistors/Yageo_Resistor_RC0402-series; Price(ILS): 0.1
R12 = RES-007: as R3 on sheet RF_A; Part_Type: Resistor; Manufacturer_Part_Number: RC0402FR-0710KL; Package: R0402; ComponentLink1Description: Datasheet; ComponentLink1URL: http://tunmcdsvn.tun.st.com/Component_Datasheet_Library/Trunk/Resistors/Yageo_Resistor_RC0402-series; Price(ILS): 0.1
R13 = RES-011: as R2 on sheet RF_A; Manufacturer_Part_Number: RC0402FR-0747KL; ComponentLink1Description: Datasheet; Part_Type: Resistor; Package: R0402; ComponentLink1URL: http://tunmcdsvn.tun.st.com/Component_Datasheet_Library/Trunk/Resistors/Yageo_Resistor_RC0402-series; Price(ILS): 0.1
R14 = RES-106: as R5 on sheet RF_A; Part_Type: Resistor; Manufacturer_Part_Number: RC0402FR-07100RL; ComponentLink1Description: Datasheet; Package: R0402; ComponentLink1URL: http://tunmcdsvn.tun.st.com/Component_Datasheet_Library/Trunk/Resistors/Yageo_Resistor_RC0402-series; Price(ILS): 0.1
U7 = ICS-112: SPD, Surge Suppressor, 4 VDC to 80 VDC, 40 uA; Manufacturer: Analog Devices; Catalog_Number: 821615429; Datasheet Link: chrome-extension://efaidnbmnnnibpcajpcglclefindmkaj/https://www.mouser.co.il/datasheet/2/609/LT4356_1_4356_2-1269492.pdf; Manufacturer_Part_Number: LT4356HMS-1#PBF; Mouser Part Number: 584-LT4356HMS-1#PBF; Mouser Price/Stock: https://www.mouser.co.il/ProductDetail/Analog-Devices/LT4356HMS-1PBF?qs=hVkxg5c3xu8TVCfpfkiVjw%3D%3D; Arrow Part Number: LT4356HMS-1#PBF; Arrow Price/Stock: https://www.arrow.com/en/products/lt4356hms-1pbf/analog-devices; Part_Type: SPD; Price(ILS): 36.33

## Nets that join several sheets
GND: RF_A (86 pins), Power_Board (8 pins)